# Altium schematic sheet dcb_lite_adc.SchDoc
size A4; SheetNumber: 5; SheetTotal: 8
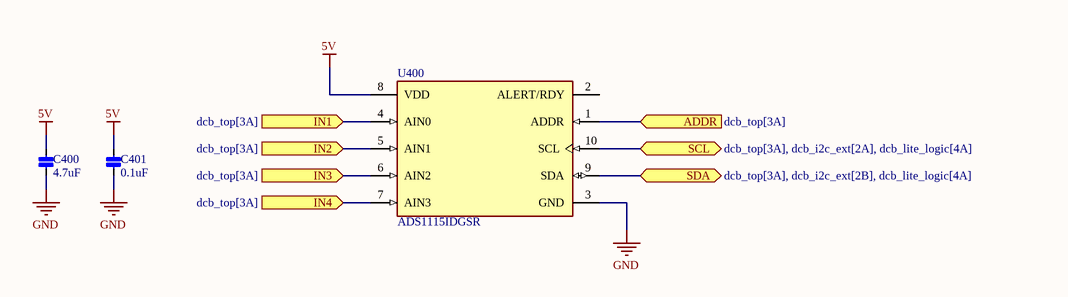
[diagram p0: dcb_lite_adc.SchDoc]

## Parts
C400  value 4.7uF  [FP-CL10-IPC_C]  (hidden comment: CAP 4.7uF 0603 6.3V X7R)
C401  value 0.1uF  [FP-CL10-IPC_B]  (hidden comment: CAP 0.1uF 50V X7R 0603)
U400  ADS1115IDGSR  [FP-DGS0010A-MFG]

## Ports
ADDR (in, see dcb_top[3A]), IN1 (in, see dcb_top[3A]), IN2 (in, see dcb_top[3A]), IN3 (in, see dcb_top[3A]), IN4 (in, see dcb_top[3A]), SCL (bidir, see dcb_top[3A], dcb_i2c_ext[2A], dcb_lite_logic[4A]), SDA (bidir, see dcb_top[3A], dcb_i2c_ext[2B], dcb_lite_logic[4A])

## Nets
5V: C400.1 C401.1 U400.8(VDD)
GND: C400.2 C401.2 U400.3(GND)
ADDR: U400.1(ADDR) ; port ADDR
IN1: U400.4(AIN0) ; port IN1
IN2: U400.5(AIN1) ; port IN2
IN3: U400.6(AIN2) ; port IN3
IN4: U400.7(AIN3) ; port IN4
SCL: U400.10(SCL) ; port SCL
SDA: U400.9(SDA) ; port SDA

Not connected (* = marked no-connect by the designer): U400 2(ALERT/RDY)

## Notes on the sheet
- Title
- Size:
- Date:
- A4
- Number:
- Time:
- Revision:
- Sheet
- of
- github.com/blueacro
- blueacro.com
- CERN OHL v2.0
- Made available under the
- File:
- © 2024 StackFoundry LLC. All Rights Reserved.

## Library data of the parts
C400 = CMP-001-00101-4: Cap Ceramic 4.7uF 6.3V X7R 10% SMD 0603 125°C Paper T/R
C401 = CMP-001-00084-7: Cap Ceramic 0.1uF 50V X7R 20% SMD 0603 125C Paper T/R; Voltage: 50V
U400 = CMP-015-00014-1: 4-Channel Single ADC Delta-Sigma 860sps 16-bit Serial 10-Pin VSSOP T/R; Sampling Rate: 860S/s; Min Supply Voltage: 2V; Number of Inputs: 4; Number of Channels: 2; Power Dissipation: 900uW; Number of Bits: 16; Max Supply Voltage: 5.5V; Number of Converters: 1; Conversion Rate: 0.86KS/s; Integral Nonlinearity (INL): 1LSB; Polarity: Bipolar; Nominal Supply Current: 150uA; Resolution: 16b; Interface: I2C; Max Operating Temperature: 125°C; Thickness: 1.02mm; Supply Type: Single; RoHS Compliant: Yes; Length: 3mm; Min Operating Temperature: -40°C; Package Quantity: 2500; Series: -; Lead Free: Lead Free; Contact Plating: Gold; Min Supply Voltage (DC): 2V; Height: 1.07mm; Case/Package: VSSOP; Width: 3mm; Packaging: Tape and Reel; Number of A/D Converters: 1; Pins: 10; Max Supply Voltage (DC): 5.5V; Reach SVHC Compliant: No